# EAGLE design binaryclock (EAGLE 6.4)
CREATOR1: Emanuel Regnath; CREATOR2: Andreas Lenz
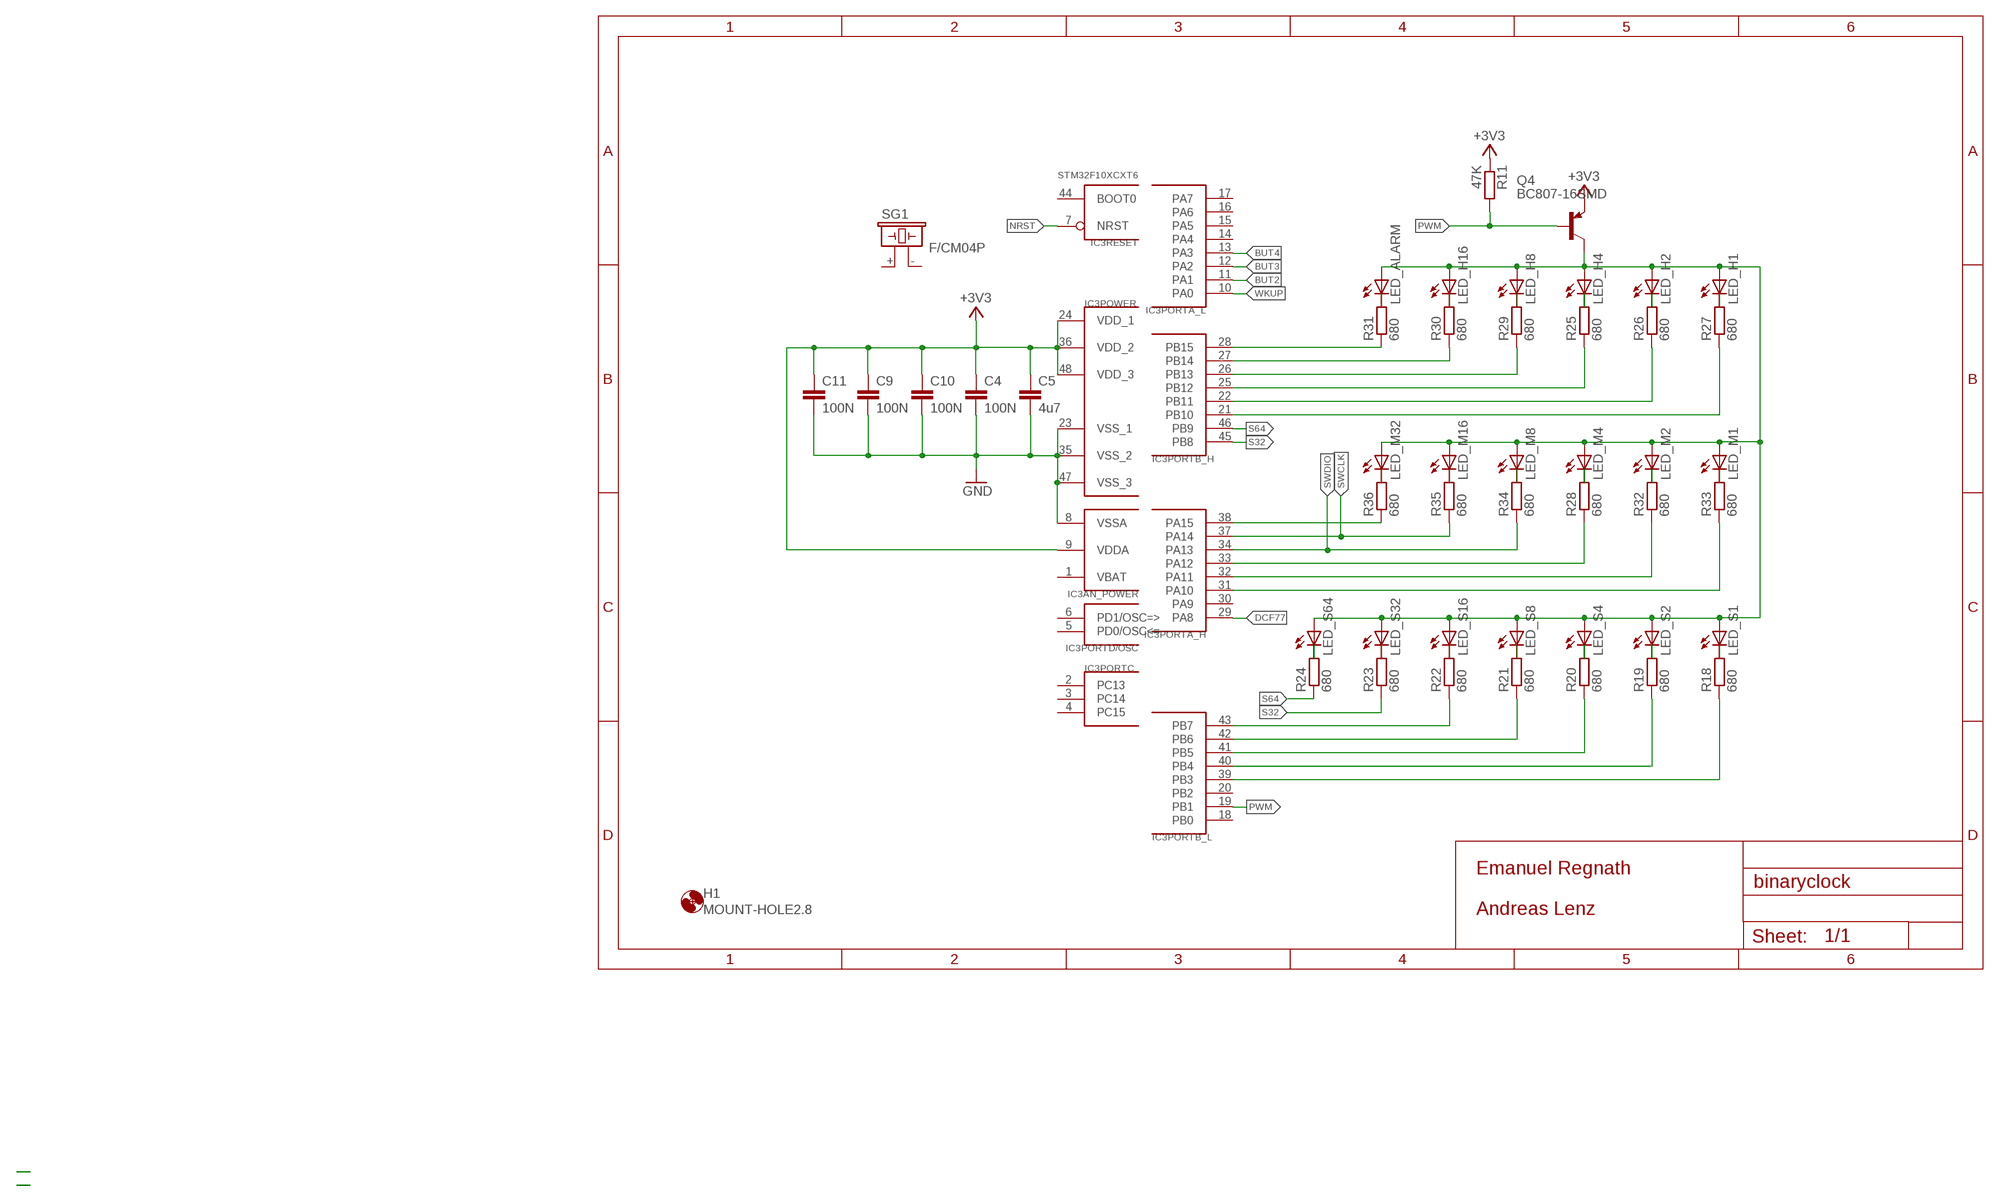
[diagram p0: schematic, sheet 1, part 1 of 2]
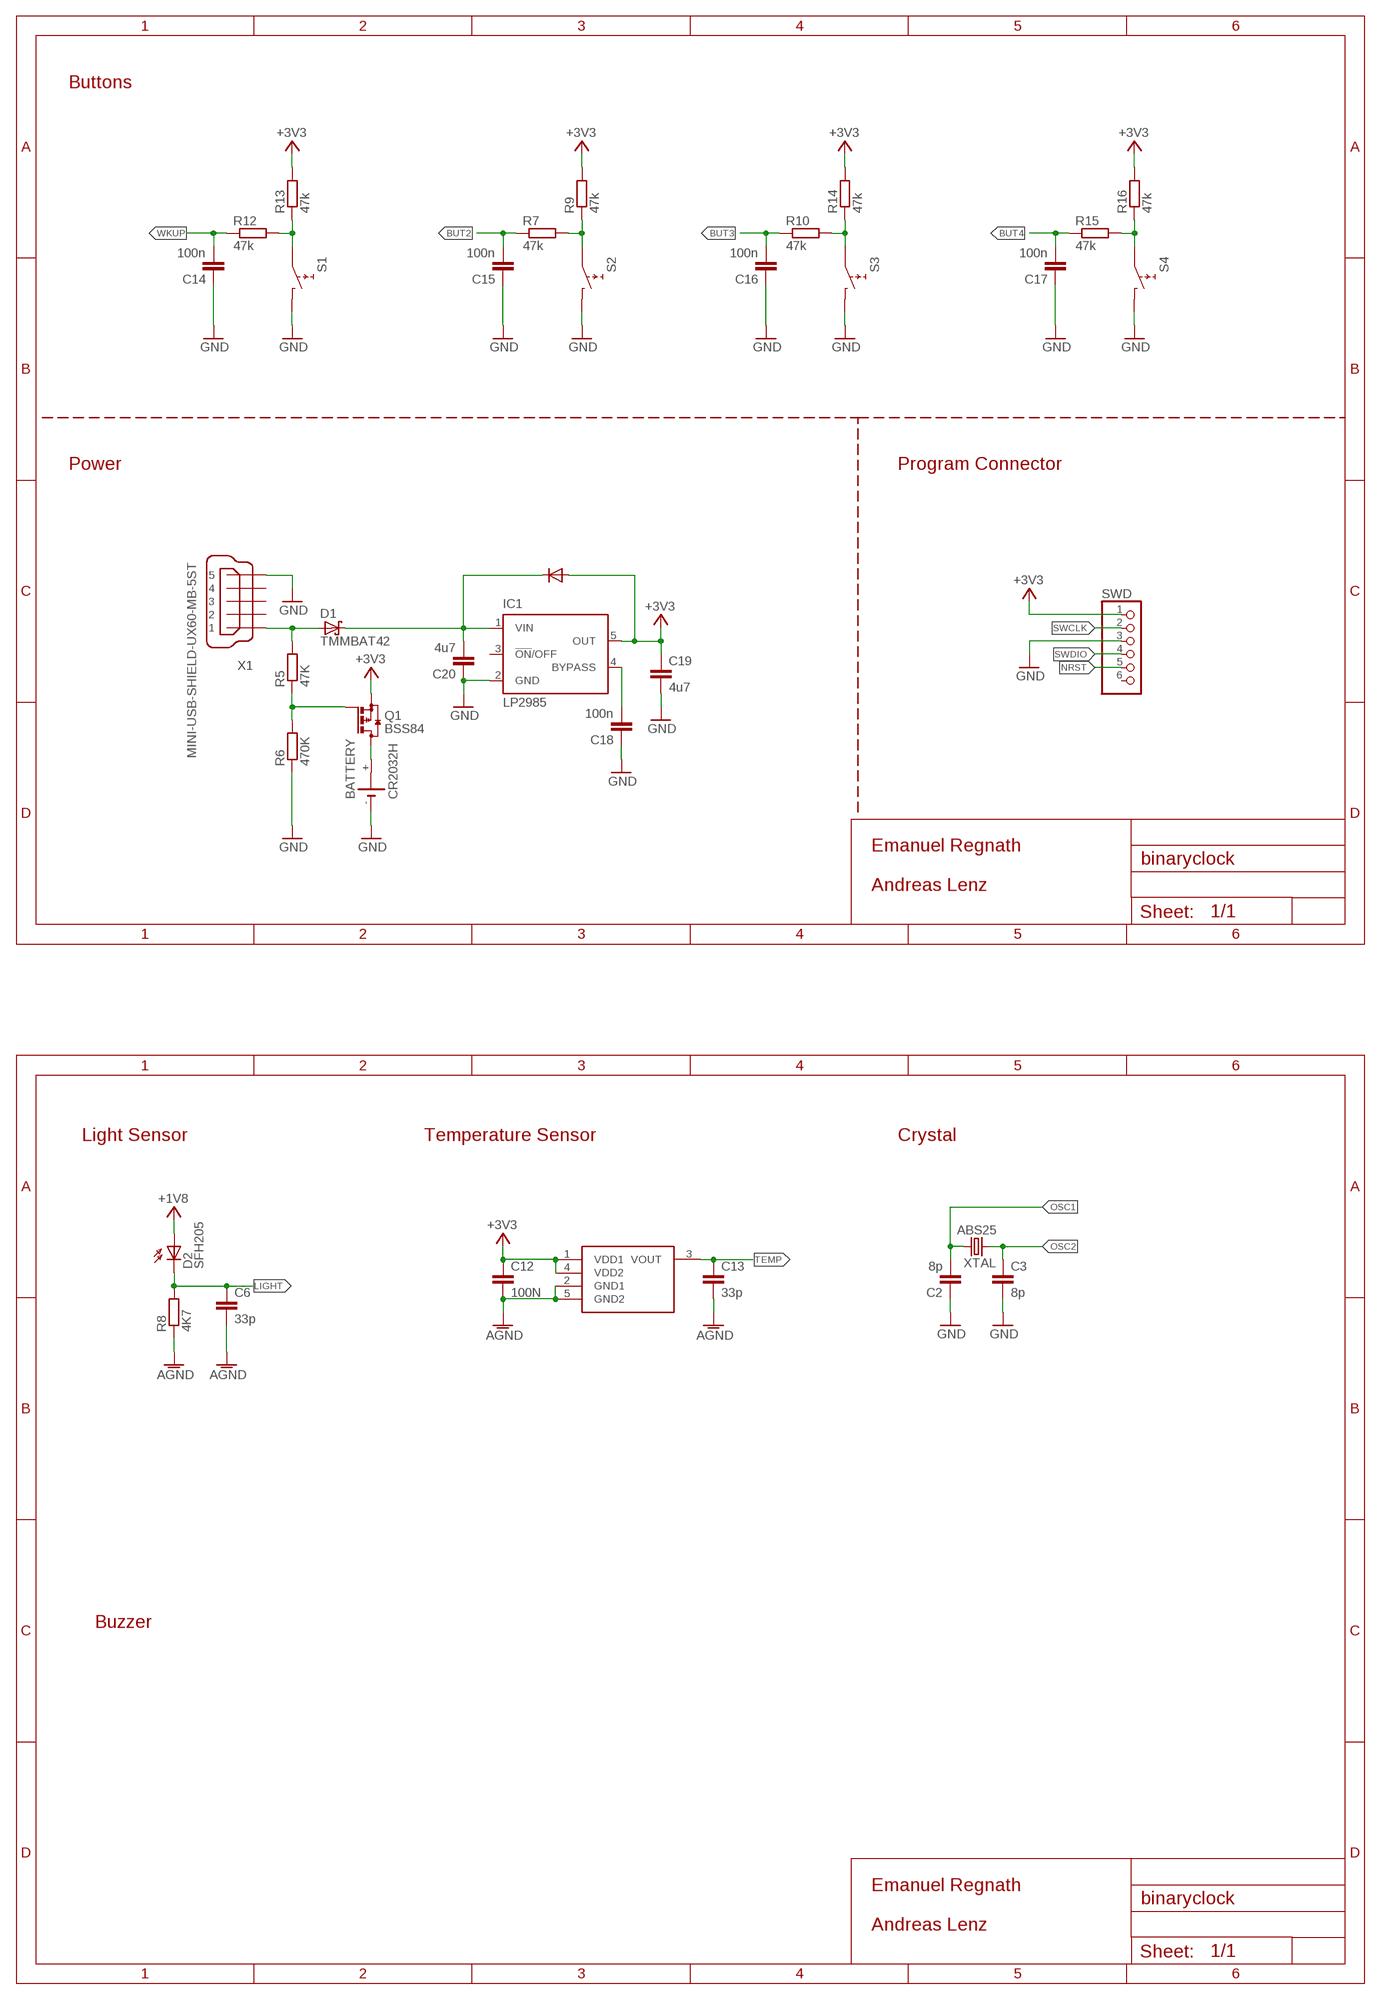
[diagram p1: schematic, sheet 1, part 2 of 2]

## Parts
BATTERY  CR2032H  [CR2032H]
BLA  LMT85  [DCK_R-PDSO-G5]
C2  8p  C-EUC0805K  [C0805K]
C3  8p  C-EUC0805K  [C0805K]
C4  100N  C-EUC0603  [C0603]
C5  4u7  C-EUC0805  [C0805]
C6  33p  C-EUC0603  [C0603]
C9  100N  C-EUC0603  [C0603]
C10  100N  C-EUC0603  [C0603]
C11  100N  C-EUC0603  [C0603]
C12  100N  C-EUC0603  [C0603]
C13  33p  C-EUC0603  [C0603]
C14  100n  C-EUC0603K  [C0603K]
C15  100n  C-EUC0603K  [C0603K]
C16  100n  C-EUC0603K  [C0603K]
C17  100n  C-EUC0603K  [C0603K]
C18  100n  C-EUC0603K  [C0603K]
C19  4u7  C-EUC0805  [C0805]
C20  4u7  C-EUC0805  [C0805]
D1  TMMBAT42  [SOD80]
D2  SFH205  [SFH205]
H1  MOUNT-HOLE2.8  [2,8]
IC1  LP2985  [SOT23-5]
IC3  STM32F10XCXT6  [TQFP48]
LED_ALARM  LEDSML0603  [SML0603]
LED_H1  LEDSML0603  [SML0603]
LED_H2  LEDSML0603  [SML0603]
LED_H4  LEDSML0603  [SML0603]
LED_H8  LEDSML0603  [SML0603]
LED_H16  LEDSML0603  [SML0603]
LED_M1  LEDSML0603  [SML0603]
LED_M2  LEDSML0603  [SML0603]
LED_M4  LEDSML0603  [SML0603]
LED_M8  LEDSML0603  [SML0603]
LED_M16  LEDSML0603  [SML0603]
LED_M32  LEDSML0603  [SML0603]
LED_S1  LEDSML0603  [SML0603]
LED_S2  LEDSML0603  [SML0603]
LED_S4  LEDSML0603  [SML0603]
LED_S8  LEDSML0603  [SML0603]
LED_S16  LEDSML0603  [SML0603]
LED_S32  LEDSML0603  [SML0603]
LED_S64  LEDSML0603  [SML0603]
Q1  BSS84  [SOT23]
Q4  BC807-16SMD  [SOT23-BEC]
R5  47K  R-EU_R0805  [R0805]
R6  470K  R-EU_R0805  [R0805]
R7  47k  R-EU_M2012  [M2012]
R8  4K7  R-EU_R0603  [R0603]
R9  47k  R-EU_M2012  [M2012]
R10  47k  R-EU_M2012  [M2012]
R11  47K  R-EU_R0805  [R0805]
R12  47k  R-EU_M2012  [M2012]
R13  47k  R-EU_M2012  [M2012]
R14  47k  R-EU_M2012  [M2012]
R15  47k  R-EU_M2012  [M2012]
R16  47k  R-EU_M2012  [M2012]
R18  680  R-EU_R0603  [R0603]
R19  680  R-EU_R0603  [R0603]
R20  680  R-EU_R0603  [R0603]
R21  680  R-EU_R0603  [R0603]
R22  680  R-EU_R0603  [R0603]
R23  680  R-EU_R0603  [R0603]
R24  680  R-EU_R0603  [R0603]
R25  680  R-EU_R0603  [R0603]
R26  680  R-EU_R0603  [R0603]
R27  680  R-EU_R0603  [R0603]
R28  680  R-EU_R0603  [R0603]
R29  680  R-EU_R0603  [R0603]
R30  680  R-EU_R0603  [R0603]
R31  680  R-EU_R0603  [R0603]
R32  680  R-EU_R0603  [R0603]
R33  680  R-EU_R0603  [R0603]
R34  680  R-EU_R0603  [R0603]
R35  680  R-EU_R0603  [R0603]
R36  680  R-EU_R0603  [R0603]
S1  SWITCH1  [SWITCH1]
S2  SWITCH1  [SWITCH1]
S3  SWITCH1  [SWITCH1]
S4  SWITCH1  [SWITCH1]
SG1  F/CM04P  [F/CM04P]
SWD  PINHD-1X6  [1X06]
X1  MINI-USB-SHIELD-UX60-MB-5ST  [UX60-MB-5ST]
XTAL  ABS25  [ABS25]

## Nets
+1V8: D2.A
+3V3: BLA.1(VDD1) BLA.4(VDD2) C4.1 C5.1 C9.1 C10.1 C11.1 C12.1 C19.1 IC1.5(OUT) IC3.9(AN_POWER:VDDA) IC3.24(POWER:VDD_1) IC3.36(POWER:VDD_2) IC3.48(POWER:VDD_3) Q1.2(S) Q4.E R9.2 R11.1 R13.2 R14.2 R16.2 SWD.1
AGND: BLA.2(GND1) BLA.5(GND2) C6.2 C12.2 C13.2 R8.1
BUT2: C15.2 IC3.11(PORTA_L:PA1) R7.1
BUT3: C16.2 IC3.12(PORTA_L:PA2) R10.1
BUT4: C17.2 IC3.13(PORTA_L:PA3) R15.1
DCF77: IC3.29(PORTA_H:PA8)
GND: BATTERY.- C2.1 C3.2 C4.2 C5.2 C9.2 C10.2 C11.2 C14.1 C15.1 C16.1 C17.1 C18.1 C19.2 C20.1 IC1.2(GND) IC3.8(AN_POWER:VSSA) IC3.23(POWER:VSS_1) IC3.35(POWER:VSS_2) IC3.47(POWER:VSS_3) R6.1 S1.P$2 S2.P$2 S3.P$2 S4.P$2 SWD.3 X1.5
LIGHT: C6.1 D2.K(C) R8.2
N$1: BATTERY.+ Q1.3(D)
N$3: Q1.1(G) R5.1 R6.2
N$5: C20.2 D1.1(C) IC1.1(VIN)
N$8: R12.2 R13.1 S1.P$1
N$9: D1.2(A) R5.2 X1.1
N$10: IC3.38(PORTA_H:PA15) R36.1
N$11: IC3.39(PORTB_L:PB3) R18.1
N$12: LED_ALARM.A LED_H1.A LED_H2.A LED_H4.A LED_H8.A LED_H16.A LED_M1.A LED_M2.A LED_M4.A LED_M8.A LED_M16.A LED_M32.A LED_S1.A LED_S2.A LED_S4.A LED_S8.A LED_S16.A LED_S32.A LED_S64.A Q4.C
N$13: R7.2 R9.1 S2.P$1
N$14: R10.2 R14.1 S3.P$1
N$15: R15.2 R16.1 S4.P$1
N$16: C18.2 IC1.4(BYPASS)
N$17: LED_M8.C R34.2
N$18: LED_S1.C R18.2
N$19: IC3.40(PORTB_L:PB4) R19.1
N$20: LED_S8.C R21.2
N$21: IC3.41(PORTB_L:PB5) R20.1
N$22: IC3.42(PORTB_L:PB6) R21.1
N$23: LED_H8.C R29.2
N$24: LED_S2.C R19.2
N$25: LED_S4.C R20.2
N$26: IC3.33(PORTA_H:PA12) R28.1
N$27: IC3.32(PORTA_H:PA11) R32.1
N$28: IC3.31(PORTA_H:PA10) R33.1
N$29: LED_H4.C R25.2
N$30: LED_S16.C R22.2
N$31: LED_S32.C R23.2
N$32: LED_S64.C R24.2
N$33: IC3.43(PORTB_L:PB7) R22.1
N$35: IC3.28(PORTB_H:PB15) R31.1
N$36: IC3.27(PORTB_H:PB14) R30.1
N$37: LED_H2.C R26.2
N$38: LED_H1.C R27.2
N$39: LED_H16.C R30.2
N$40: LED_ALARM.C R31.2
N$41: LED_M4.C R28.2
N$42: LED_M2.C R32.2
N$43: LED_M1.C R33.2
N$44: LED_M16.C R35.2
N$45: LED_M32.C R36.2
N$46: IC3.26(PORTB_H:PB13) R29.1
N$47: IC3.25(PORTB_H:PB12) R25.1
N$48: IC3.22(PORTB_H:PB11) R26.1
N$49: IC3.21(PORTB_H:PB10) R27.1
NRST: IC3.7(RESET:NRST) SWD.5
OSC1: C2.2 XTAL.1
OSC2: C3.1 XTAL.4
PWM: IC3.19(PORTB_L:PB1) Q4.B R11.2
S32: IC3.45(PORTB_H:PB8) R23.1
S64: IC3.46(PORTB_H:PB9) R24.1
SWCLK: IC3.37(PORTA_H:PA14) R35.1 SWD.2
SWDIO: IC3.34(PORTA_H:PA13) R34.1 SWD.4
TEMP: BLA.3(VOUT) C13.1
WKUP: C14.2 IC3.10(PORTA_L:PA0) R12.1
Unconnected: BATTERY.+@1(+) IC1.3(!ON!/OFF) IC3.2(PORTC:PC13) IC3.3(PORTC:PC14) IC3.4(PORTC:PC15) IC3.5(PORTD/OSC:PD0/OSC<=) IC3.6(PORTD/OSC:PD1/OSC=>) IC3.14(PORTA_L:PA4) IC3.15(PORTA_L:PA5) IC3.16(PORTA_L:PA6) IC3.17(PORTA_L:PA7) IC3.18(PORTB_L:PB0) IC3.20(PORTB_L:PB2) IC3.30(PORTA_H:PA9) IC3.44(RESET:BOOT0) SG1.+ SG1.- SWD.6 X1.2 X1.3 X1.4 X1.M1(S1) X1.M2(S2) X1.M3(S3) X1.M4(S4)

## Notes on the sheet
- Buttons
- Power | Program Connector
- Light Sensor | Temperature Sensor | Crystal
- Buzzer

## Power pins joined to a net without a drawn wire
VBAT: IC3.1(AN_POWER:VBAT)

## Library data of the parts
BATTERY = battery:CR2032H: LI BATTERY Varta
BLA = custom_emu:LMT85
C2-C6 C9-C20 = rcl:C-EU: CAPACITOR, European symbol
D1 = custom_emu:TMMBAT42: Silicon Schottky Diodes General-purpose diode for high-speed switching
D2 = opto-trans-siemens:SFH205: PHOTO DIODE; OC_FARNELL: unknown; OC_NEWARK: unknown
H1 = holes:MOUNT-HOLE: MOUNTING HOLE with drill center marker
IC1 = custom_emu:LP2985: SIMPLE SWITCHER® Power Converter 150 kHz 3A Step-Down Voltage Regulator Source: http://www.national.com/ds/LM/LM2596.pdf
IC3 = stm32:STM32F10XCXT6: ST STM32F101/103 48pin LQFP
LED_ALARM LED_H1 LED_H2 LED_H4 LED_H8 LED_H16 LED_M1 LED_M2 LED_M4 LED_M8 LED_M16 LED_M32 LED_S1 LED_S2 LED_S4 LED_S8 LED_S16 LED_S32 LED_S64 = led:LED: LED OSRAM: - CHIPLED LG R971, LG N971, LY N971, LG Q971, LY Q971, LO R971, LY R971 LH N974, LH R974 LS Q976, LO Q976, LY Q976 LO Q996 - Hyper CHIPLED LW Q18S LB Q993, LB Q99A, LB R99A - SideLED LS A670, LO A670, LY A670, LG A670, LP A670 LB A673, LV A673, LT A673, LW A673 LH A674 LY A675 LS A676, LA A676, LO A676, LY A676, LW A676 LS A679, LY A679, LG A679 - Hyper Micro SIDELED® LS Y876, LA Y876, LO Y876, LY Y876 LT Y87S - SmartLED LW L88C, LW L88S LB L89C, LB L89S, LG L890 LS L89K, LO L89K, LY L89K LS L896, LA L896, LO L896, LY L896 - TOPLED LS T670, LO T670, LY T670, LG T670, LP T670 LSG T670, LSP T670, LSY T670, LOP T670, LYG T670 LG T671, LOG T671, LSG T671 LB T673, LV T673, LT T673, LW T673 LH T674 LS T676, LA T676, LO T676, LY T676, LB T676, LH T676, LSB T676, LW T676 LB T67C, LV T67C, LT T67C, LS T67K, LO T67K, LY T67K, LW E67C LS E67B, LA E67B, LO E67B, LY E67B, LB E67C, LV E67C, LT E67C LW T67C LS T679, LY T679, LG T679 LS T770, LO T770, LY T770, LG T770, LP T770 LB T773, LV T773, LT T773, LW T773 LH T774 LS E675, LA E675, LY E675, LS T675 LS T776, LA T776, LO T776, LY T776, LB T776 LHGB T686 LT T68C, LB T68C - Hyper Mini TOPLED® LB M676 - Mini TOPLED Santana® LG M470 LS M47K, LO M47K, LY M47K Source: http://www.osram.convergy.de LUXEON: - LUMILED® LXK2-PW12-R00, LXK2-PW12-S00, LXK2-PW14-U00, LXK2-PW14-V00 LXK2-PM12-R00, LXK2-PM12-S00, LXK2-PM14-U00 LXK2-PE12-Q00, LXK2-PE12-R00, LXK2-PE12-S00, LXK2-PE14-T00, LXK2-PE14-U00 LXK2-PB12-K00, LXK2-PB12-L00, LXK2-PB12-M00, LXK2-PB14-N00, LXK2-PB14-P00, LXK2-PB14-Q00 LXK2-PR12-L00, LXK2-PR12-M00, LXK2-PR14-Q00, LXK2-PR14-R00 LXK2-PD12-Q00, LXK2-PD12-R00, LXK2-PD12-S00 LXK2-PH12-R00, LXK2-PH12-S00 LXK2-PL12-P00, LXK2-PL12-Q00, LXK2-PL12-R00 Source: www.luxeon.com KINGBRIGHT: KA-3528ASYC Source: www.kingbright.com
Q1 = transistor-small-signal:BSS84: P-CHANNEL MOS FET
Q4 = transistor-pnp:BC807*: PNP Transistror
R5 R6 R8 R11 R18-R36 = resistor:R-EU_: RESISTOR, European symbol
R7 R9 R10 R12-R16 = rcl:R-EU_: RESISTOR, European symbol
S1-S4 = custom_emu:SWITCH1: PUSH SWITCH 6mm x 3.5mm
SG1 = buzzer:F/CM04P: BUZZER Source: Buerklin; OC_FARNELL: unknown; OC_NEWARK: unknown
SWD = pinhead:PINHD-1X6: PIN HEADER
X1 = con-hirose:MINI-USB-SHIELD-: MINI USB Connector Source: http://www.hirose.co.jp/cataloge_hp/e24000019.pdf; OC_FARNELL: unknown; OC_NEWARK: unknown
XTAL = custom_emu:ABS25: ABS Crystal 32.768 kHz 10ppm 6pF SMD; MPN: MC-306 60.0KHZ 100PPM ,12.5PF; OC_FARNELL: 1278040; OC_NEWARK: 31M5576

## Net classes
0 default: clearance 0.355 mm

## Board
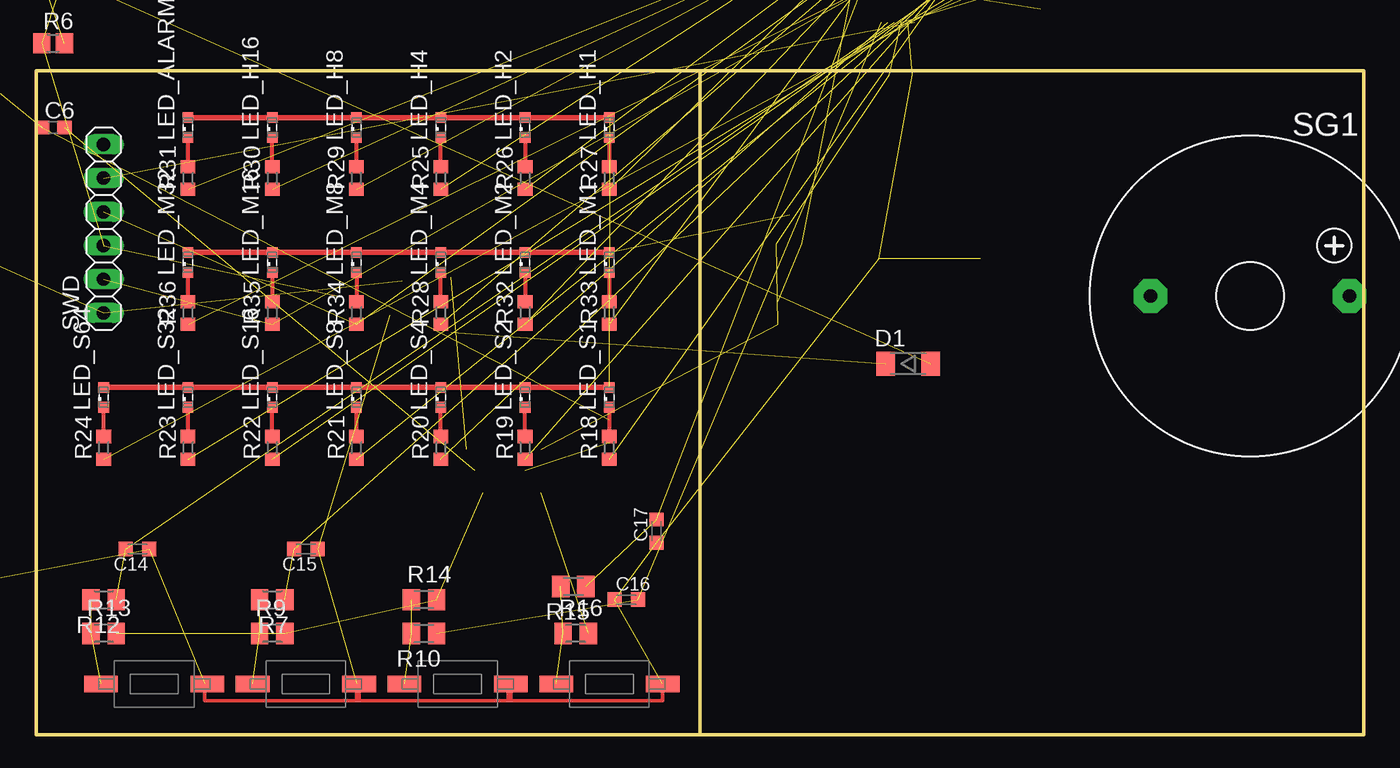
[diagram p2: board, top side]
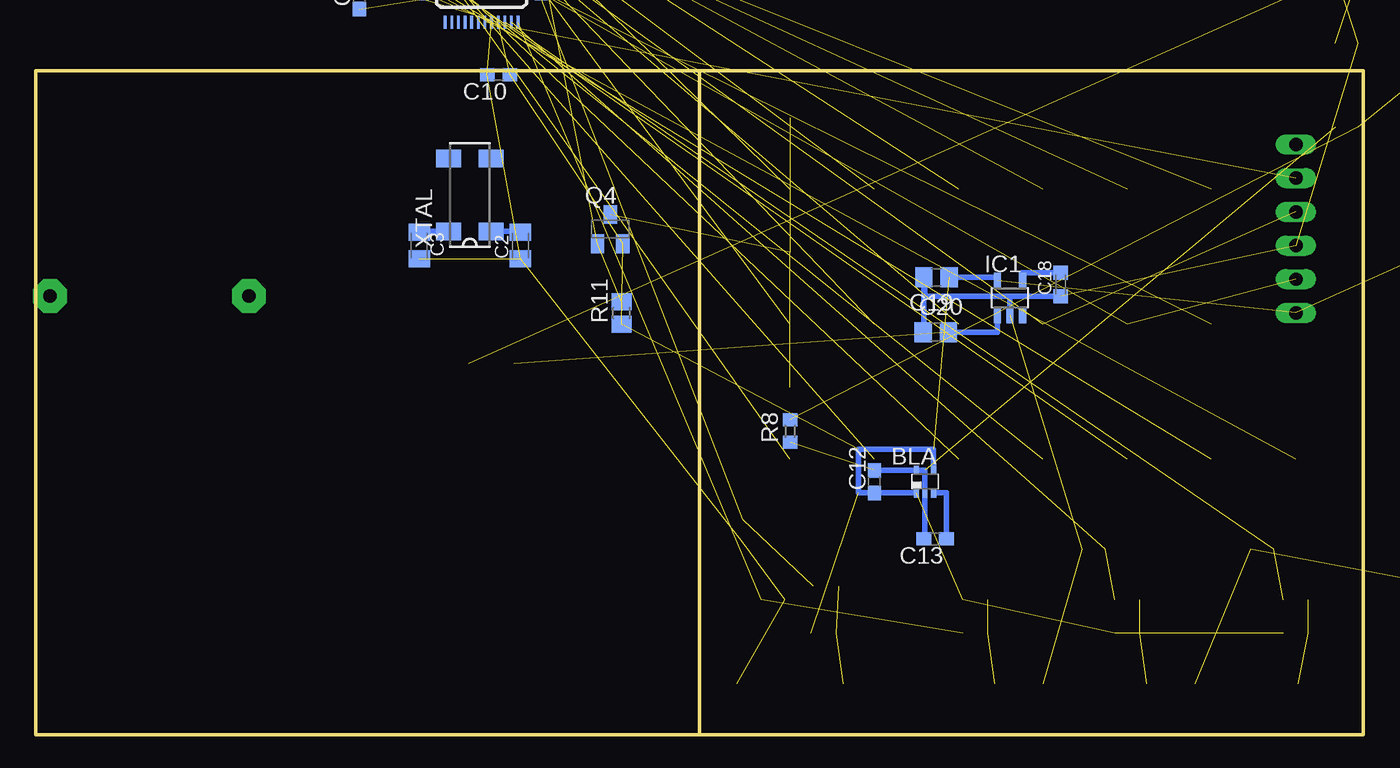
[diagram p3: board, bottom side, seen from below]

Size 100 x 50 mm. Coordinates in mm from the lower left corner, seen from the top.
Outline: 50,0 0,0 0,50 50,50
Outline: 50,0 50,50
Outline: 50,0 100,0 100,50 50,50
Copper layers (1*16): Top 0.035mm / dielectric 1.5mm / Bottom 0.035mm
Design rules "default": minimum track width 10mil, minimum drill 24mil, track to track 8mil, track to pad 8mil, pad to pad 8mil, via to via 8mil, smd to smd 8mil, copper to edge 40mil, drill to drill 8mil, minimum pad ring 10mil, minimum via ring 8mil, stop-mask expansion 4mil, vias tented up to drill 0mil, thermal gap 10mil

### Footprints (pad centres in the part's own frame; a part is rotated, then mirrored left to right if it is on the bottom)
CR2032H = drill 1.118 pad 2.54 octagon: + 5.08,10.795; +@1 -5.08,10.795; - 0,-6.985
DCK_R-PDSO-G5 = smd 0.4 x 0.7: 1 -0.65,-0.85; 2 0,-0.85; 3 0.65,-0.85; 4 0.65,0.85; 5 -0.65,0.85
C0805K = smd 1.3 x 1.6: 1 -1,0; 2 1,0
C0603 = smd 1.1 x 1: 1 -0.85,0; 2 0.85,0
C0805 = smd 1.3 x 1.5: 1 -0.95,0; 2 0.95,0
C0603K = smd 1.05 x 1.08: 1 -0.875,0; 2 0.875,0
SOD80 = smd 1.4 x 1.8: 1 -1.7,0; 2 1.7,0
SFH205 = drill 0.813 long: A 0,-1.27; K 0,1.27
2,8 = hole 2.8: 0,0
SOT23-5 = smd 0.55 x 1.2: 1 -0.95,-1.3; 2 0,-1.3; 3 0.95,-1.3; 4 0.95,1.3; 5 -0.95,1.3
TQFP48 = smd 0.2 x 1: 1 -2.75,-4.5; 2 -2.25,-4.5; 3 -1.75,-4.5; 4 -1.25,-4.5; 5 -0.75,-4.5; 6 -0.25,-4.5; 7 0.25,-4.5; 8 0.75,-4.5; 9 1.25,-4.5; 10 1.75,-4.5; 11 2.25,-4.5; 12 2.75,-4.5; 25 2.75,4.5; 26 2.25,4.5; 27 1.75,4.5; 28 1.25,4.5; 29 0.75,4.5; 30 0.25,4.5; 31 -0.25,4.5; 32 -0.75,4.5; 33 -1.25,4.5; 34 -1.75,4.5; 35 -2.25,4.5; 36 -2.75,4.5 | smd 1 x 0.2: 13 4.5,-2.75; 14 4.5,-2.25; 15 4.5,-1.75; 16 4.5,-1.25; 17 4.5,-0.75; 18 4.5,-0.25; 19 4.5,0.25; 20 4.5,0.75; 21 4.5,1.25; 22 4.5,1.75; 23 4.5,2.25; 24 4.5,2.75; 37 -4.5,2.75; 38 -4.5,2.25; 39 -4.5,1.75; 40 -4.5,1.25; 41 -4.5,0.75; 42 -4.5,0.25; 43 -4.5,-0.25; 44 -4.5,-0.75; 45 -4.5,-1.25; 46 -4.5,-1.75; 47 -4.5,-2.25; 48 -4.5,-2.75
SML0603 = smd 0.8 x 0.8: A 0.75,0; C -0.75,0
SOT23 = smd 1 x 1.4: 1 -0.95,-1.1; 2 0.95,-1.1; 3 0,1.1
SOT23-BEC = smd 1 x 1.4: B -0.95,-1.1; C 0,1.1; E 0.95,-1.1
R0805 = smd 1.3 x 1.5: 1 -0.85,0; 2 0.85,0
M2012 = smd 1.3 x 1.6: 1 -0.95,0; 2 0.95,0
R0603 = smd 1 x 1.1: 1 -0.85,0; 2 0.85,0
SWITCH1 = smd 2.54 x 1.27: P$1 -4.01,0; P$2 4.01,0
F/CM04P = drill 1.016 pad 2.54 octagon: + 7.493,0; - -7.493,0
1X06 = drill 1.016 long: 1 -6.35,0; 2 -3.81,0; 3 -1.27,0; 4 1.27,0; 5 3.81,0; 6 6.35,0
UX60-MB-5ST = smd 2 x 0.5: 1 2.25,1.6; 2 2.25,0.8; 3 2.25,0; 4 2.25,-0.8; 5 2.25,-1.6 | smd 2.2 x 2.5: M1 -3.3,-4.2; M2 -3.3,4.2; M3 2,4.2; M4 2,-4.2 | hole 0.9: 0,-1.75; 0,1.75
ABS25 = smd 1.3 x 1.9: 1 -2.75,-1.6; 2 2.75,-1.6; 3 2.75,1.6; 4 -2.75,1.6

### Placement (x,y rotation side)
BATTERY  -48.26,10.16 0 top  (outside the outline)
BLA  33.02,19.05 0 bottom
C2  63.5,36.83 90 bottom
C3  71.12,36.83 270 bottom
C4  69.08,66.67 0 bottom  (outside the outline)
C5  54.04,60.88 270 bottom  (outside the outline)
C6  1.27,45.72 0 top
C9  56.59,60.66 270 bottom  (outside the outline)
C10  65.14,49.69 180 bottom
C11  75.63,55.49 90 bottom  (outside the outline)
C12  36.83,19.05 90 bottom
C13  32.25,14.74 180 bottom
C14  7.62,13.97 180 top
C15  20.32,13.97 180 top
C16  44.45,10.16 0 top
C17  46.73,15.32 90 top
C18  22.81,33.89 90 bottom
C19  32.15,34.43 180 bottom
C20  32.2,30.31 0 bottom
D1  65.69,27.94 0 top
D2  -29.21,68.58 0 top  (outside the outline)
H1  -64.77,60.96 0 top  (outside the outline)
IC1  26.62,32.89 0 bottom
IC3  66.42,58.15 0 bottom  (outside the outline)
LED_ALARM  11.43,45.72 90 top
LED_H1  43.18,45.72 90 top
LED_H2  36.83,45.72 90 top
LED_H4  30.48,45.72 90 top
LED_H8  24.13,45.72 90 top
LED_H16  17.78,45.72 90 top
LED_M1  43.18,35.56 90 top
LED_M2  36.83,35.56 90 top
LED_M4  30.48,35.56 90 top
LED_M8  24.13,35.56 90 top
LED_M16  17.78,35.56 90 top
LED_M32  11.43,35.56 90 top
LED_S1  43.18,25.4 90 top
LED_S2  36.83,25.4 90 top
LED_S4  30.48,25.4 90 top
LED_S8  24.13,25.4 90 top
LED_S16  17.78,25.4 90 top
LED_S32  11.43,25.4 90 top
LED_S64  5.08,25.4 90 top
Q1  -58.42,60.96 0 top  (outside the outline)
Q4  56.73,38.06 0 bottom
R5  1.27,57.15 0 top  (outside the outline)
R6  1.27,52.07 0 top
R7  17.78,10.16 180 top
R8  43.18,22.86 90 bottom
R9  17.78,7.62 0 top
R10  29.21,7.62 180 top
R11  55.88,31.75 90 bottom
R12  5.08,10.16 180 top
R13  5.08,7.62 0 top
R14  29.21,10.16 0 top
R15  40.46,11.16 180 top
R16  40.64,7.62 0 top
R18  43.18,21.59 90 top
R19  36.83,21.59 90 top
R20  30.48,21.59 90 top
R21  24.13,21.59 90 top
R22  17.78,21.59 90 top
R23  11.43,21.59 90 top
R24  5.08,21.59 90 top
R25  30.48,41.91 90 top
R26  36.83,41.91 90 top
R27  43.18,41.91 90 top
R28  30.48,31.75 90 top
R29  24.13,41.91 90 top
R30  17.78,41.91 90 top
R31  11.43,41.91 90 top
R32  36.83,31.75 90 top
R33  43.18,31.75 90 top
R34  24.13,31.75 90 top
R35  17.78,31.75 90 top
R36  11.43,31.75 90 top
S1  8.89,3.81 0 top
S2  20.32,3.81 0 top
S3  31.75,3.81 0 top
S4  43.18,3.81 0 top
SG1  91.44,33.02 0 top
SWD  5.08,38.1 90 top
X1  3.81,71.12 0 top  (outside the outline)
XTAL  67.31,40.64 90 bottom

### Tracks (layer width: path | path; a pad name or v marks a point on that pad's centre or on a via)
+3V3  (18 unrouted)
  Bottom 0.406: C19.1 27.57,34.43 IC1.5 | BLA.1 C12.1 38.04,18.2 38.04,21.5 32.37,21.5 BLA.4
AGND  (2 unrouted)
  Bottom 0.406: C12.2 BLA.5 33.02,19.9 BLA.2 33.02,14.74 C13.2
BUT2  (2 unrouted)
BUT3  (2 unrouted)
BUT4  (2 unrouted)
GND  (20 unrouted)
  Top 0.254: S1.P$2 12.7,3.81 12.7,2.54 24.13,2.54 | 24.13,2.54 24.33,2.54 | 24.33,2.54 S2.P$2 24.13,3.81 24.13,2.54 | 24.33,2.54 35.56,2.54 | 35.56,2.54 35.76,2.54 | 35.76,2.54 S3.P$2 35.56,3.81 35.56,2.54 | 35.76,2.54 47.19,2.54 S4.P$2
  Bottom 0.406: C20.1 33.1,30.31 C19.2 33.04,34.43 33.04,33.02 | C18.1 26.62,33.02 | 26.62,33.02 IC1.2 | 26.62,33.02 33.04,33.02 | 33.04,33.02 33.04,33
LIGHT  (2 unrouted)
N$1  (1 unrouted)
N$3  (2 unrouted)
N$5  (1 unrouted)
  Bottom 0.406: C20.2 27.57,30.31 IC1.1
N$8  (2 unrouted)
N$9  (2 unrouted)
N$10  (1 unrouted)
N$11  (1 unrouted)
N$12  (3 unrouted)
  Top 0.406: LED_ALARM.A LED_H16.A LED_H8.A LED_H4.A LED_H2.A LED_H1.A | LED_M32.A LED_M16.A LED_M8.A LED_M4.A LED_M2.A LED_M1.A | LED_S64.A LED_S32.A LED_S16.A LED_S8.A LED_S4.A LED_S2.A LED_S1.A
N$13  (2 unrouted)
N$14  (2 unrouted)
N$15  (2 unrouted)
N$16
  Bottom 0.406: IC1.4 25.67,34.77 C18.2
N$17
  Top 0.305: LED_M8.C R34.2
N$18
  Top 0.305: R18.2 LED_S1.C
N$19  (1 unrouted)
N$20
  Top 0.305: R21.2 LED_S8.C
N$21  (1 unrouted)
N$22  (1 unrouted)
N$23
  Top 0.305: R29.2 LED_H8.C
N$24
  Top 0.305: R19.2 LED_S2.C
N$25
  Top 0.305: R20.2 LED_S4.C
N$26  (1 unrouted)
N$27  (1 unrouted)
N$28  (1 unrouted)
N$29
  Top 0.305: R25.2 LED_H4.C
N$30
  Top 0.305: R22.2 LED_S16.C
N$31
  Top 0.305: R23.2 LED_S32.C
N$32
  Top 0.305: R24.2 LED_S64.C
N$33  (1 unrouted)
N$35  (1 unrouted)
N$36  (1 unrouted)
N$37
  Top 0.305: LED_H2.C R26.2
N$38
  Top 0.305: R27.2 LED_H1.C
N$39
  Top 0.305: R30.2 LED_H16.C
N$40
  Top 0.305: R31.2 LED_ALARM.C
N$41
  Top 0.305: R28.2 LED_M4.C
N$42
  Top 0.305: LED_M2.C R32.2
N$43
  Top 0.305: R33.2 LED_M1.C
N$44
  Top 0.305: LED_M16.C R35.2
N$45
  Top 0.305: R36.2 LED_M32.C
N$46  (1 unrouted)
N$47  (1 unrouted)
N$48  (1 unrouted)
N$49  (1 unrouted)
NRST  (1 unrouted)
OSC1
  Bottom 0.406: XTAL.1 63.5,37.89 C2.2
OSC2
  Bottom 0.406: XTAL.4 71.12,37.89 C3.1
PWM  (2 unrouted)
S32  (1 unrouted)
S64  (1 unrouted)
SWCLK  (2 unrouted)
SWDIO  (2 unrouted)
TEMP
  Bottom 0.406: BLA.3 31.4,18.2 C13.1
WKUP  (2 unrouted)

### Text on the board
Dimension: Board: 5x5 oder 5x10